# Altium schematic sheet 参考电路.SchDoc
size 292 x 193 mm; Author: Power Lin; SheetNumber: 1; SheetTotal: 1; Website: wiki-power.com
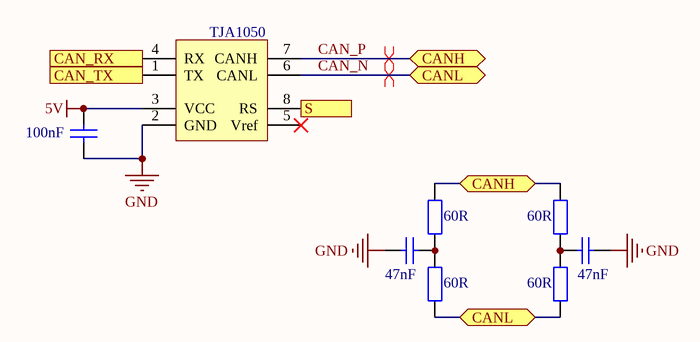
[diagram p0: 参考电路.SchDoc]

## Parts
(Parts that share a designator on the sheet are numbered #1, #2 ... from top to bottom, then left to right.)
C?#1  100nF  [CAP-0603]
C?#2  47nF  [CAP-0603]
C?#3  47nF  [CAP-0603]
R?#1  60R  [R-0603]
R?#2  60R  [R-0603]
R?#3  60R  [R-0603]
R?#4  60R  [R-0603]
U?  TJA1050  [SOIC_8]

## Ports
CAN_RX (in), CAN_TX (out), CANH (bidir), CANL (bidir), S (in)

## Nets
5V: C?#1.2 U?.3(VCC)
GND: C?#1.1 C?#2.2 C?#3.2 U?.2(GND)
CAN_N: R?#3.2 R?#4.1 U?.6(CANL) ; port CANL
CAN_P: R?#1.1 R?#2.2 U?.7(CANH) ; port CANH
CAN_RX: U?.4(RX) ; port CAN_RX
CAN_TX: U?.1(TX) ; port CAN_TX
S: U?.8(RS) ; port S
NetC?#2_1: C?#2.1 R?#1.2 R?#3.1
NetC?#3_1: C?#3.1 R?#2.1 R?#4.2

Not connected (* = marked no-connect by the designer): U? 5(Vref)*

## Layout directives
differential pair: CAN_N, CAN_P

## Notes on the sheet
- Author
- DocumentName
- ModifiedDate
- ProjectName
- SheetNumber
- SheetTotal
- Website
- Revision

## Library data of the parts
C?#1-C?#3 = CAP: 贴片电容; ComponentLink1Description: 供应商链接; ComponentLink1URL: http://www.szlcsc.com/product/details_53938.html; Package: 0402; Supplier: LC; SuppliersPartNumber: C52923
R?#1-R?#4 = RES: 贴片电阻; Package: 0805; Supplier: LC; SuppliersPartNumber: C17798
U? = TJA1050: CAN 控制器（5V）